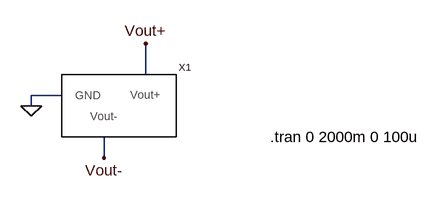
[diagram p0: schematic test.asc]
test.asc, the LTspice schematic file:
Version 4
SHEET 1 880 680
WIRE 208 128 208 80
WIRE 80 160 32 160
WIRE 32 176 32 160
WIRE 144 256 144 224
FLAG 32 176 0
FLAG 208 80 Vout+
FLAG 144 256 Vout-
SYMBOL Component_3 160 176 R0
SYMATTR InstName X1
TEXT 400 224 Left 2 !.tran 0 2000m 0 100u

The netlist it stands for:
* test.asc
XX1 Vout- Vout+ 0 Component_3  ; pins Vout- Vout+ GND
.tran 0 2000m 0 100u
.backanno
.end